# EAGLE schematic Differential_ADC_Driver_sch (EAGLE 7.2.0)
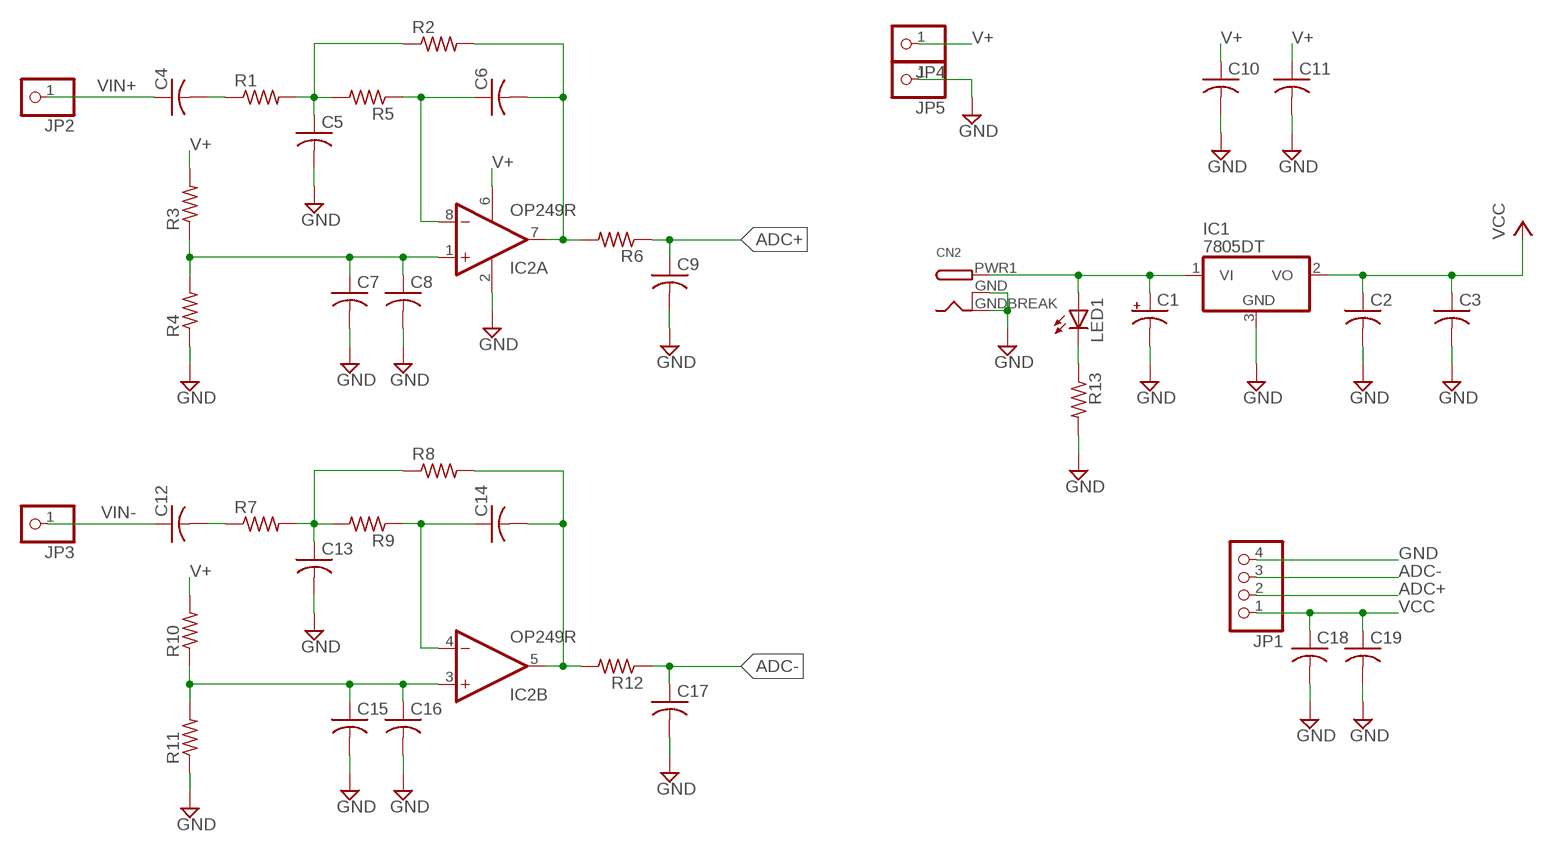
[diagram p0: schematic, sheet 1]

## Parts
C1  CPOL-US153CLV-0405  [153CLV-0405]
C2  C-USC0805  [C0805]
C3  C-USC0805  [C0805]
C4  C-USC0402  [C0402]
C5  C-USC0402  [C0402]
C6  C-USC0402  [C0402]
C7  C-USC0402  [C0402]
C8  C-USC0402  [C0402]
C9  C-USC0402  [C0402]
C10  C-USC0402  [C0402]
C11  C-USC0402  [C0402]
C12  C-USC0402  [C0402]
C13  C-USC0402  [C0402]
C14  C-USC0402  [C0402]
C15  C-USC0402  [C0402]
C16  C-USC0402  [C0402]
C17  C-USC0402  [C0402]
C18  C-USC0805  [C0805]
C19  C-USC0805  [C0805]
CN2  DCBARRELSMT  [DCJACK_2MM_SMT]
IC1  7805DT  [TO252]
IC2  OP249R  [SO08]
JP1  PINHD-1X4  [1X04]
JP2  PINHD-1X1  [1X01]
JP3  PINHD-1X1  [1X01]
JP4  PINHD-1X1  [1X01]
JP5  PINHD-1X1  [1X01]
LED1  LEDCHIP-LED0603  [CHIP-LED0603]
R1  R-US_R0402  [R0402]
R2  R-US_R0402  [R0402]
R3  R-US_R0402  [R0402]
R4  R-US_R0402  [R0402]
R5  R-US_R0402  [R0402]
R6  R-US_R0402  [R0402]
R7  R-US_R0402  [R0402]
R8  R-US_R0402  [R0402]
R9  R-US_R0402  [R0402]
R10  R-US_R0402  [R0402]
R11  R-US_R0402  [R0402]
R12  R-US_R0402  [R0402]
R13  R-US_R0402  [R0402]

## Nets
ADC+: C9.1 JP1.2 R6.1
ADC-: C17.1 JP1.3 R12.1
GND: C1.- C2.2 C3.2 C5.2 C7.2 C8.2 C9.2 C10.2 C11.2 C13.2 C15.2 C16.2 C17.2 C18.2 C19.2 CN2.GND(GNDBREAK) CN2.GNDBREAK(GND) IC1.3(GND) IC2.2(P:V-) JP1.4 JP5.1 R4.1 R11.1 R13.2
N$1: C7.1 C8.1 IC2.1(A:+IN) R3.1 R4.2
N$2: C4.2 R1.1
N$3: C5.1 R1.2 R2.1 R5.2
N$4: C6.1 IC2.8(A:-IN) R5.1
N$5: C6.2 IC2.7(A:OUT) R2.2 R6.2
N$6: C12.2 R7.1
N$7: C13.1 R7.2 R8.1 R9.2
N$8: C14.1 IC2.4(B:-IN) R9.1
N$9: C14.2 IC2.5(B:OUT) R8.2 R12.2
N$10: C15.1 C16.1 IC2.3(B:+IN) R10.1 R11.2
N$11: LED1.C R13.1
N$12: C1.+ CN2.PWR1(PWR) IC1.1(VI) LED1.A
V+: C10.1 C11.1 IC2.6(P:V+) JP4.1 R3.2 R10.2
VCC: C2.1 C3.1 C18.1 C19.1 IC1.2(VO) JP1.1
VIN+: C4.1 JP2.1
VIN-: C12.1 JP3.1

## Library data of the parts
C1 = adafruit:CPOL-US: POLARIZED CAPACITOR, American symbol
C2-C19 = adafruit:C-US: CAPACITOR, American symbol
CN2 = adafruit:DCBARREL: 2.0mm DC Barrel Jack DCJACK_2MM_PTH - Through Hole Jack (4UConnector: 05537)
IC1 = adafruit:78*: Positive VOLTAGE REGULATOR Added bigger pads to the TO-92 package
IC2 = linear:OP249: Dual, Precision JFET High Speed Operational Amplifier Source: http://www.analog.com/static/imported-files/data_sheets/OP249.pdf
JP1 = pinhead:PINHD-1X4: PIN HEADER
JP2-JP5 = adafruit:PINHD-1X1: Pin header 1x1 for 0.1" spacing With round pins
LED1 = adafruit:LED: LED OSRAM: - CHIPLED LG R971, LG N971, LY N971, LG Q971, LY Q971, LO R971, LY R971 LH N974, LH R974 LS Q976, LO Q976, LY Q976 LO Q996 - Hyper CHIPLED LW Q18S LB Q993, LB Q99A, LB R99A - SideLED LS A670, LO A670, LY A670, LG A670, LP A670 LB A673, LV A673, LT A673, LW A673 LH A674 LY A675 LS A676, LA A676, LO A676, LY A676, LW A676 LS A679, LY A679, LG A679 - Hyper Micro SIDELED® LS Y876, LA Y876, LO Y876, LY Y876 LT Y87S - SmartLED LW L88C, LW L88S LB L89C, LB L89S, LG L890 LS L89K, LO L89K, LY L89K LS L896, LA L896, LO L896, LY L896 - TOPLED LS T670, LO T670, LY T670, LG T670, LP T670 LSG T670, LSP T670, LSY T670, LOP T670, LYG T670 LG T671, LOG T671, LSG T671 LB T673, LV T673, LT T673, LW T673 LH T674 LS T676, LA T676, LO T676, LY T676, LB T676, LH T676, LSB T676, LW T676 LB T67C, LV T67C, LT T67C, LS T67K, LO T67K, LY T67K, LW E67C LS E67B, LA E67B, LO E67B, LY E67B, LB E67C, LV E67C, LT E67C LW T67C LS T679, LY T679, LG T679 LS T770, LO T770, LY T770, LG T770, LP T770 LB T773, LV T773, LT T773, LW T773 LH T774 LS E675, LA E675, LY E675, LS T675 LS T776, LA T776, LO T776, LY T776, LB T776 LHGB T686 LT T68C, LB T68C - Hyper Mini TOPLED® LB M676 - Mini TOPLED Santana® LG M470 LS M47K, LO M47K, LY M47K Source: http://www.osram.convergy.de/
R1-R13 = adafruit:R-US_: RESISTOR, American symbol